# Altium schematic sheet CPU.SchDoc
size A4
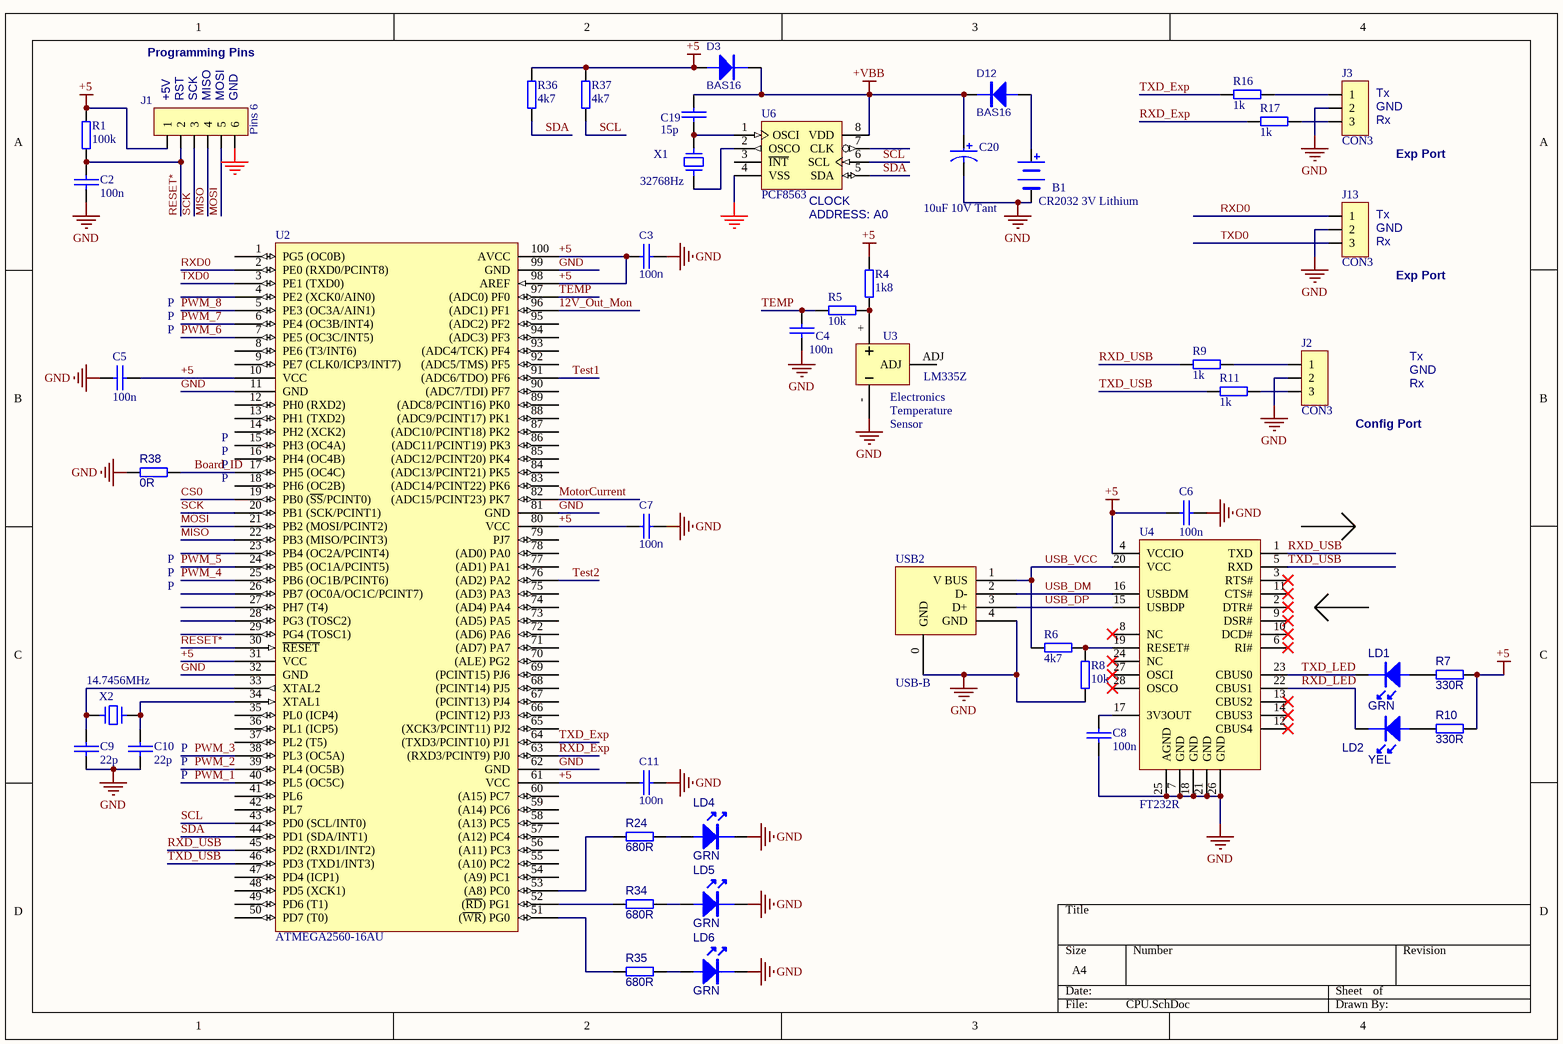
[diagram p0: CPU.SchDoc]

## Parts
B1  CR2032 3V Lithium  [COINBATT6]
C2  100n  [0603]
C3  100n  [0603]
C4  100n  [0603]
C5  100n  [0603]
C6  100n  [0603]
C7  100n  [0603]
C8  100n  [0603]
C9  22p  [0603]
C10  22p  [0603]
C11  100n  [0603]
C19  15p  [0603]
C20  10uF 10V Tant  [SMD-TANT-A]
D3  BAS16  [SOT-23-bat54]
D12  BAS16  [SOT-23-bat54]
J1  Pins 6  [SIP6]
J2  CON3  [SIP3]
J3  CON3  [SIP3]
J13  CON3  [SIP3]
LD1  GRN  [0805DIODE]
LD2  YEL  [0805DIODE]
LD4  GRN  [0805DIODE]
LD5  GRN  [0805DIODE]
LD6  GRN  [0805DIODE]
R1  100k  [0603]
R4  1k8  [0603]
R5  10k  [0603]
R6  4k7  [0603]
R7  330R  [0603]
R8  10k  [0603]
R9  1k  [0603]
R10  330R  [0603]
R11  1k  [0603]
R16  1k  [0603]
R17  1k  [0603]
R24  680R  [0603]
R34  680R  [0603]
R35  680R  [0603]
R36  4k7  [0603]
R37  4k7  [0603]
R38  0R  [0603]
U2  ATMEGA2560-16AU  [100T1_N]
U3  LM335Z  [TO-92_LM335]
U4  FT232R  [ssop28]
U6  PCF8563  [so-8]
USB2  USB-B  [USB_BV]
X1  32768Hz  [XTAL32K]
X2  14.7456MHz  [XTAL-V2]

## Nets
+5: C3.2 C5.1 C6.2 C7.2 C11.2 D3.A J1.1 R1.2 R4.1 R7.1 R10.1 R36.2 R37.2 U2.10(VCC) U2.31(VCC) U2.61(VCC) U2.80(VCC) U2.98(AREF) U2.100(AVCC) U4.4(VCCIO)
+VBB: C19.1 C20.1 D3.K D12.K U6.8(VDD)
GND: B1.- C2.1 C3.1 C4.2 C5.2 C6.1 C7.1 C8.1 C9.2 C10.2 C11.1 C20.2 J1.6 J2.2 J3.2 J13.2 LD4.K LD5.K LD6.K R8.1 R38.1 U2.11(GND) U2.32(GND) U2.62(GND) U2.81(GND) U2.99(GND) U3.- U4.7(GND) U4.18(GND) U4.21(GND) U4.25(AGND) U4.26(GND) U6.4(VSS) USB2.0(GND) USB2.4(GND)
12V_Out_Mon: U2.96((ADC1)_PF1)
Board_ID: R38.2 U2.17(PH5_(OC4C))
CS0: U2.19(PB0_(~{SS}/PCINT0))
MISO: J1.4 U2.22(PB3_(MISO/PCINT3))
MOSI: J1.5 U2.21(PB2_(MOSI/PCINT2))
MotorCurrent: U2.82((ADC15/PCINT23)_PK7)
PWM_1: U2.40(PL5_(OC5C))
PWM_2: U2.39(PL4_(OC5B))
PWM_3: U2.38(PL3_(OC5A))
PWM_4: U2.25(PB6_(OC1B/PCINT6))
PWM_5: U2.24(PB5_(OC1A/PCINT5))
PWM_6: U2.7(PE5_(OC3C/INT5))
PWM_7: U2.6(PE4_(OC3B/INT4))
PWM_8: U2.5(PE3_(OC3A/AIN1))
RESET*: C2.2 J1.2 R1.1 U2.30(~{RESET})
RXD0: J13.1 U2.2(PE0_(RXD0/PCINT8))
RXD_Exp: R17.1 U2.63((RXD3/PCINT9)_PJ0)
RXD_LED: LD2.K U4.22(CBUS1)
RXD_USB: R9.1 U2.45(PD2_(RXD1/INT2)) U4.1(TXD)
SCK: J1.3 U2.20(PB1_(SCK/PCINT1))
SCL: R37.1 U2.43(PD0_(SCL/INT0)) U6.6(SCL)
SDA: R36.1 U2.44(PD1_(SDA/INT1)) U6.5(SDA)
TEMP: C4.1 R5.1 U2.97((ADC0)_PF0)
Test1: U2.91((ADC6/TDO)_PF6)
Test2: U2.76((AD2)_PA2)
TXD0: J13.3 U2.3(PE1_(TXD0))
TXD_Exp: R16.1 U2.64((TXD3/PCINT10)_PJ1)
TXD_LED: LD1.K U4.23(CBUS0)
TXD_USB: R11.1 U2.46(PD3_(TXD1/INT3)) U4.5(RXD)
USB_DM: U4.16(USBDM) USB2.2(D-)
USB_DP: U4.15(USBDP) USB2.3(D+)
USB_VCC: R6.1 U4.20(VCC) USB2.1(V_BUS)
NetB1_+: B1.+ D12.A
NetC8_2: C8.2 U4.17(3V3OUT)
NetC9_1: C9.1 U2.33(XTAL2) X2.2
NetC10_1: C10.1 U2.34(XTAL1) X2.1
NetC19_2: C19.2 U6.1(OSCI) X1.2
NetJ2_1: J2.1 R9.2
NetJ2_3: J2.3 R11.2
NetJ3_1: J3.1 R16.2
NetJ3_3: J3.3 R17.2
NetLD1_A: LD1.A R7.2
NetLD2_A: LD2.A R10.2
NetLD4_A: LD4.A R24.2
NetLD5_A: LD5.A R34.2
NetLD6_A: LD6.A R35.2
NetR4_2: R4.2 R5.2 U3.+
NetR6_2: R6.2 R8.2 U4.19(RESET#)
NetR24_1: R24.1 U2.53((A8)_PC0)
NetR34_1: R34.1 U2.52((~{RD})_PG1)
NetR35_1: R35.1 U2.51((~{WR})_PG0)
NetU6_2: U6.2(OSCO) X1.1

Not connected (* = marked no-connect by the designer): U2 1(PG5_(OC0B)) 4(PE2_(XCK0/AIN0)) 8(PE6_(T3/INT6)) 9(PE7_(CLK0/ICP3/INT7)) 12(PH0_(RXD2)) 13(PH1_(TXD2)) 14(PH2_(XCK2)) 15(PH3_(OC4A)) 16(PH4_(OC4B)) 18(PH6_(OC2B)) 23(PB4_(OC2A/PCINT4)) 26(PB7_(OC0A/OC1C/PCINT7)) 27(PH7_(T4)) 28(PG3_(TOSC2)) 29(PG4_(TOSC1)) 35(PL0_(ICP4)) 36(PL1_(ICP5)) 37(PL2_(T5)) 41(PL6) 42(PL7) 47(PD4_(ICP1)) 48(PD5_(XCK1)) 49(PD6_(T1)) 50(PD7_(T0)) 54((A9)_PC1) 55((A10)_PC2) 56((A11)_PC3) 57((A12)_PC4) 58((A13)_PC5) 59((A14)_PC6) 60((A15)_PC7) 65((XCK3/PCINT11)_PJ2) 66((PCINT12)_PJ3) 67((PCINT13)_PJ4) 68((PCINT14)_PJ5) 69((PCINT15)_PJ6) 70((ALE)_PG2) 71((AD7)_PA7) 72((AD6)_PA6) 73((AD5)_PA5) 74((AD4)_PA4) 75((AD3)_PA3) 77((AD1)_PA1) 78((AD0)_PA0) 79(PJ7) 83((ADC14/PCINT22)_PK6) 84((ADC13/PCINT21)_PK5) 85((ADC12/PCINT20)_PK4) 86((ADC11/PCINT19)_PK3) 87((ADC10/PCINT18)_PK2) 88((ADC9/PCINT17)_PK1) 89((ADC8/PCINT16)_PK0) 90((ADC7/TDI)_PF7) 92((ADC5/TMS)_PF5) 93((ADC4/TCK)_PF4) 94((ADC3)_PF3) 95((ADC2)_PF2); U3 ADJ; U4 2(DTR#)* 3(RTS#)* 6(RI#)* 8(NC)* 9(DSR#)* 10(DCD#)* 11(CTS#)* 12(CBUS4)* 13(CBUS2)* 14(CBUS3)* 24(NC)* 27(OSCI)* 28(OSCO)*; U6 3(~{INT}) 7(CLK)

## Notes on the sheet
- Programming Pins
- (near J1) +5V
- (near J1) RST
- (near J1) SCK
- (near J1) MISO
- (near J1) MOSI
- (near J1) GND
- (near J3) Tx
- (near J3) Rx
- (near J3) GND
- (near J3) Exp Port
- ADDRESS: A0
- (near U6) CLOCK
- (near J13) Tx
- (near J13) Rx
- (near J13) GND
- P
- (near J13) Exp Port
- Tx
- Rx
- GND
- (near U3) Electronics
- (near U3) Temperature
- (near U3) Sensor
- (near J2) Config Port
- (near C10) P

## Library data of the parts
B1 = BATTERY
C2 C4 C5 = cap
C3 C6-C11 C19 = CAP
C20 = CAPACITOR POL-S
D3 D12 = DIODE
J1 = CON6
LD1 LD2 LD4-LD6 = LED
R1 R9 R11 R16 R17 = res8
R4-R8 R10 R24 R34-R38 = RES8
U2 = ATMEGA2560(TQFP100)
X1 X2 = CRYSTAL